# Altium project Projeto_DAC_Raspberry.PrjPcb (part 2 of 2)

## Sheet Amp_op2.SchDoc: AmpOps de Potência
size A3; Address1: UFCG; Address2: Laboratório VIRTUS CC; Address3: Campina Grande, PB - Brasil; SheetNumber: 5; SheetTotal: 8; Project: HAT RPi 4 - Phase Shifter Fotônico; DocumentRev: 01; SCH_SCALE: N/A; Version: v1.0
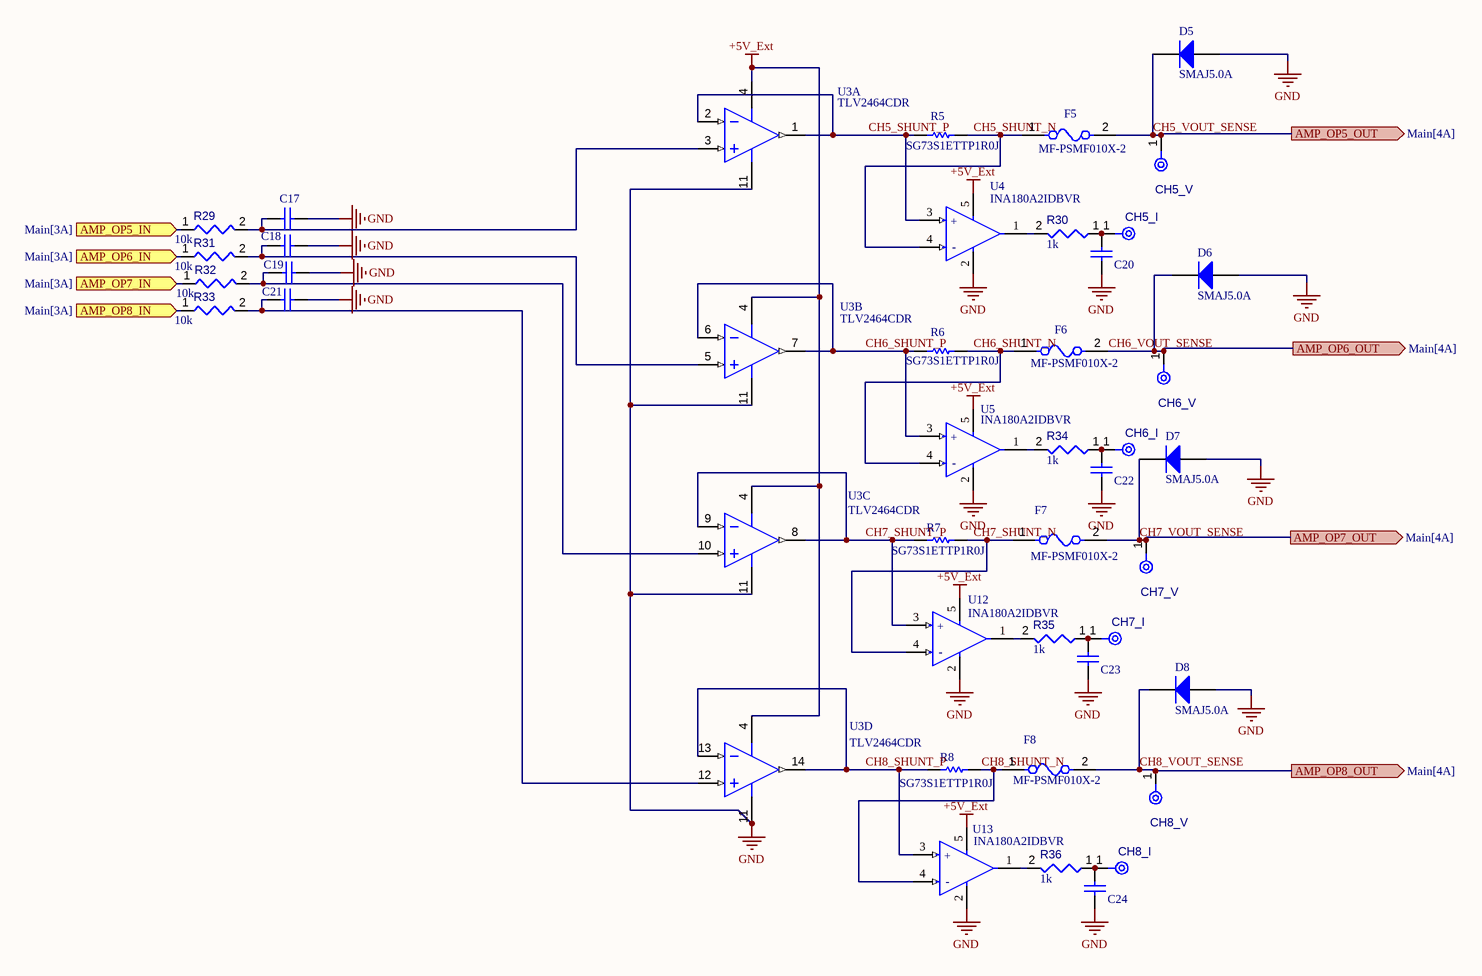
[diagram p4: Amp_op2.SchDoc]

### Parts
C17  VJ0603Y104MXJCW1BC  [CAPC1608X95X40NL15T15]  (value not drawn)
C18  VJ0603Y104MXJCW1BC  [CAPC1608X95X40NL15T15]  (value not drawn)
C19  VJ0603Y104MXJCW1BC  [CAPC1608X95X40NL15T15]  (value not drawn)
C20  VJ0603Y104MXJCW1BC  [CAPC1608X95X40NL15T15]  (value not drawn)
C21  VJ0603Y104MXJCW1BC  [CAPC1608X95X40NL15T15]  (value not drawn)
C22  VJ0603Y104MXJCW1BC  [CAPC1608X95X40NL15T15]  (value not drawn)
C23  VJ0603Y104MXJCW1BC  [CAPC1608X95X40NL15T15]  (value not drawn)
C24  VJ0603Y104MXJCW1BC  [CAPC1608X95X40NL15T15]  (value not drawn)
CH5_I  TPAD6R  [TP06R]  (value not drawn)  (no BOM)
CH5_V  TPAD6R  [TP06R]  (value not drawn)  (no BOM)
CH6_I  TPAD6R  [TP06R]  (value not drawn)  (no BOM)
CH6_V  TPAD6R  [TP06R]  (value not drawn)  (no BOM)
CH7_I  TPAD6R  [TP06R]  (value not drawn)  (no BOM)
CH7_V  TPAD6R  [TP06R]  (value not drawn)  (no BOM)
CH8_I  TPAD6R  [TP06R]  (value not drawn)  (no BOM)
CH8_V  TPAD6R  [TP06R]  (value not drawn)  (no BOM)
D5  SMAJ5.0A  [BOUR-SMA-2_V]
D6  SMAJ5.0A  [BOUR-SMA-2_V]
D7  SMAJ5.0A  [BOUR-SMA-2_V]
D8  SMAJ5.0A  [BOUR-SMA-2_V]
F5  MF-PSMF010X-2  [FP-MF-PSMF-MFG]
F6  MF-PSMF010X-2  [FP-MF-PSMF-MFG]
F7  MF-PSMF010X-2  [FP-MF-PSMF-MFG]
F8  MF-PSMF010X-2  [FP-MF-PSMF-MFG]
R5  SG73S1ETTP1R0J  [RESC1005X40X25LL10T10]
R6  SG73S1ETTP1R0J  [RESC1005X40X25LL10T10]
R7  SG73S1ETTP1R0J  [RESC1005X40X25LL10T10]
R8  SG73S1ETTP1R0J  [RESC1005X40X25LL10T10]
R29  value 10k  [RESC0603(1608)_L]  (hidden comment: Resistor 10k +/-1% 0603 100 mW)
R30  value 1k  [RESC0603(1608)_L]  (hidden comment: Resistor 1k +/-1% 0603 100 mW)
R31  value 10k  [RESC0603(1608)_L]  (hidden comment: Resistor 10k +/-1% 0603 100 mW)
R32  value 10k  [RESC0603(1608)_L]  (hidden comment: Resistor 10k +/-1% 0603 100 mW)
R33  value 10k  [RESC0603(1608)_L]  (hidden comment: Resistor 10k +/-1% 0603 100 mW)
R34  value 1k  [RESC0603(1608)_L]  (hidden comment: Resistor 1k +/-1% 0603 100 mW)
R35  value 1k  [RESC0603(1608)_L]  (hidden comment: Resistor 1k +/-1% 0603 100 mW)
R36  value 1k  [RESC0603(1608)_L]  (hidden comment: Resistor 1k +/-1% 0603 100 mW)
U3  TLV2464CDR  [D0014A_N]  (parts A,B,C,D of 4)
U4  INA180A2IDBVR  [FP-DBV0005A-MFG]
U5  INA180A2IDBVR  [FP-DBV0005A-MFG]
U12  INA180A2IDBVR  [FP-DBV0005A-MFG]
U13  INA180A2IDBVR  [FP-DBV0005A-MFG]

### Ports
AMP_OP5_IN (in, see Main[3A]), AMP_OP5_OUT (out, see Main[4A]), AMP_OP6_IN (in, see Main[3A]), AMP_OP6_OUT (out, see Main[4A]), AMP_OP7_IN (in, see Main[3A]), AMP_OP7_OUT (out, see Main[4A]), AMP_OP8_IN (in, see Main[3A]), AMP_OP8_OUT (out, see Main[4A])

### Nets
+5V_Ext: U3.4(VDD+) U4.5(VS) U5.5(VS) U12.5(VS) U13.5(VS)
GND: C17.2 C18.2 C19.2 C20.2 C21.2 C22.2 C23.2 C24.2 D5.1(A) D6.1(A) D7.1(A) D8.1(A) U3.11(GND) U4.2(GND) U5.2(GND) U12.2(GND) U13.2(GND)
CH5_SHUNT_N: F5.1 R5.2 U4.4(IN-)
CH5_SHUNT_P: R5.1 U3.1(OUT1) U3.2(IN1-) U4.3(IN+)
CH5_VOUT_SENSE: CH5_V.1(TP) D5.2(K) F5.2 ; port AMP_OP5_OUT
CH6_SHUNT_N: F6.1 R6.2 U5.4(IN-)
CH6_SHUNT_P: R6.1 U3.6(IN2-) U3.7(OUT2) U5.3(IN+)
CH6_VOUT_SENSE: CH6_V.1(TP) D6.2(K) F6.2 ; port AMP_OP6_OUT
CH7_SHUNT_N: F7.1 R7.2 U12.4(IN-)
CH7_SHUNT_P: R7.1 U3.8(OUT3) U3.9(IN3-) U12.3(IN+)
CH7_VOUT_SENSE: CH7_V.1(TP) D7.2(K) F7.2 ; port AMP_OP7_OUT
CH8_SHUNT_N: F8.1 R8.2 U13.4(IN-)
CH8_SHUNT_P: R8.1 U3.13(IN4-) U3.14(OUT4) U13.3(IN+)
CH8_VOUT_SENSE: CH8_V.1(TP) D8.2(K) F8.2 ; port AMP_OP8_OUT
NetC17_1: C17.1 R29.2 U3.3(IN1+)
NetC18_1: C18.1 R31.2 U3.5(IN2+)
NetC19_1: C19.1 R32.2 U3.10(IN3+)
NetC20_1: C20.1 CH5_I.1(TP) R30.1
NetC21_1: C21.1 R33.2 U3.12(IN4+)
NetC22_1: C22.1 CH6_I.1(TP) R34.1
NetC23_1: C23.1 CH7_I.1(TP) R35.1
NetC24_1: C24.1 CH8_I.1(TP) R36.1
NetR29_1: R29.1 ; port AMP_OP5_IN
NetR30_2: R30.2 U4.1(OUT)
NetR31_1: R31.1 ; port AMP_OP6_IN
NetR32_1: R32.1 ; port AMP_OP7_IN
NetR33_1: R33.1 ; port AMP_OP8_IN
NetR34_2: R34.2 U5.1(OUT)
NetR35_2: R35.2 U12.1(OUT)
NetR36_2: R36.2 U13.1(OUT)

### Notes on the sheet
- REVISION
- DESCRIPTION
- DATE
- APPROVED
- ADDRESS
- PROJECT
- VERSION
- TITLE
- A3
- SIZE
- SCALE
- DOCUMENT NAME:
- DOCUMENT REVISION:
- OF
- SHEET:
- PROJECT REVISION:
- (in symbol CMP-04895-000287-1) +; -

### Library data of the parts
C17-C24 = CMP-2006-00058-1: Manufacturer: Vitramon; Part Number: VJ0603Y104MXJCW1BC
CH5_I CH5_V CH6_I CH6_V CH7_I CH7_V CH8_I CH8_V = CMP-00028-00002-2: 0.6mm round; Pins: 1; Component Type: Mechanical
D5-D8 = CMP-2000-07090-1: SMAJ Transient Voltage Suppressor Diode Series, 3.5 V, -55 to 150 degC, 2-Pin SMA, RoHS, Tape and Reel; Manufacturer: Bourns; EDA / CAD Models: DownloadfromAcceleratedDesigns; Unidirectional Channels: 1; Voltage - Breakdown (Min): 6.4V; Voltage - Reverse Standoff (Typ): 5V; Voltage - Clamping (Max) @ Ipp: 9.2V; Other Names: SMAJ5.0ABDKR; Type: Zener; Catalog Drawings: SMAJSeriesFootprintSMAJ,SMBJSeries; Featured Product: SMAJ/SMBJ/SMCJ/SMLJDiscreteTVSDiodes; Power - Peak Pulse: 400W; Current - Peak Pulse (10/1000µs): 43.5A; Power Line Protection: No; Online Catalog: SMAJSeries; Supplier Device Package: SMA(DO-214AC); Operating Temperature: -55°C~150°C(TJ); Package Description: 2-Pin Surface Mount Device, Body 4.315 x 2.605 mm; Datasheet URL: https://datasheet.ciiva.com/25624/0900766b8112213b-25624680.pdf; Manufacturer URL: http://www.bourns.com/; Datasheet Version: 08/2012; Series: SMAJ; Family: TVS-Diodes; Bidirectional Channels: -; Applications: GeneralPurpose; Package Reference: SMA-2; Standard Package: 1; Package / Case: DO-214AC,SMA; Category: CircuitProtection; RoHS Information: SMAJSeriesMaterialDeclaration; Mounting Technology: SurfaceMount; Capacitance @ Frequency: -; Packaging: Digi-Reel®; Mounting Type: SurfaceMount
F5-F8 = CMP-07400-000017-1: PTC RESET FUSE 15V 100MA 0805; Manufacturer: Bourns Inc.; Resistance: 1-7.5Ω; Value: 1-7.5Ω; Current Rating: 40A; Hold Current: 0.1A; Trip Current: 0.3A; Trip Time: 1.5s; Temperature: -40°C to +85°C; ComponentLink2Description: Datasheet; Lead Free: Yes; Ipc Land Pattern Name: CAPC215135X67; Device Class L1: Circuit Protection; Mouser Description: Resettable Fuses - PPTC 0.10A 15V 1ohm; Automotive: No; Octopart: https://octopart.com/mf-psmf010x-2-bourns-7483441; Manufacturer Part Number: MF-PSMF010X-2; RoHS: TRUE; Temperature Range High: +85°C; Digikey Description: PTC RESET FUSE 15V 100MA 0805; Device Class L3: unset; ComponentLink2URL: https://www.bourns.com/docs/Product-Datasheets/mfpsmf.pdf; Height: 0.85mm; Voltage Rating: 15V; Ambient Temperature Range Low: -40°C; Category: Fuse; Package: MF-PSMF; Temperature Range Low: -40°C; Device Class L2: PTC Resettable Fuses; Ambient Temperature Range High: +85°C
R5-R8 = CMP-2002-04124-1: Manufacturer: KOA Speer; Part Number: SG73S1ETTP1R0J
R29 R31-R33 = CMP-009-00017-7: Chip Resistor, 10 KOhm, +/- 1%, 01 W, -55 to 155 degC, 0603 (1608 Metric); Manufacturer: Vishay; Manufacturer Part Number: CRCW060310K0FKEA; Voltage Rating: 50V; Power: 100mW; RoHS Compliant: True; Min Operating Temperature: -55°C; Pins: 2; Case/Package: 0603; Mounting Technology: SM; Max Operating Temperature: 155°C; Tolerance: 1%; Component Type: Resistors
R30 R34-R36 = CMP-009-00014-6: Chip Resistor, 1 KOhm, +/-1%, 0.1 W, -55 to 155 degC, 0603 (1608 Metric); Manufacturer: Yageo; Manufacturer Part Number: RC0603FR-131KL; Power: 100mW; Tolerance: 1%; Voltage Rating: 50V; Mounting Technology: SM; Case/Package: 0603; Min Operating Temperature: -55°C; RoHS Compliant: True; Max Operating Temperature: 155°C; Pins: 2; Component Type: Resistors
U3 = CMP-0271-00006-3: Quad Low Power, Rail-to-Rail Input / Output Operational Amplifier, 2.7 to 6 V, 0 to 70 degC, 14-pin SOIC (D14), Green (RoHS & no Sb/Br); Manufacturer: Texas Instruments; Offset Drift(Typ)(uV/C): 2; Total Supply Voltage(Min)(+5V is 5, +/-5V is 10): 2.7; IIB(Max)(pA): 14000; CMRR(Min)(dB): 66; Iq per channel(Max)(mA): 0.575; Vn at 1kHz(Typ)(nV/rtHz): 11; Slew Rate(Typ)(V/us): 1.6; Number of Channels: 4; Sub Family: High Output Current Amplifier (>=50mA), Low Supply Voltage Amplifier (<=2.7V), Precision Amplifier; Total Supply Voltage(Max)(+5V is 5, +/-5V is 10): 6; ComponentLink3URL: http://www.ti.com/lit/ml/mpds177g/mpds177g.pdf; ComponentLink1Description: Manufacturer URL; PackageReference: D0014A; Vio (25C)(Max)(mV): 2; Mounting Technology: Surface Mount; PackageDescription: 14-Pin Plastic Small Outline, Body 8.65 x 3.9 mm, Pitch 1.27 mm; ComponentLink2Description: Datasheet; ComponentLink3Description: Package Specification; ComponentLink1URL: http://www.ti.com/; DatasheetVersion: SLOS220J; PartNumber: TLV2464CDR; Code_JEDEC: MS-012; PackageVersion: 4040047-5/M, 06/2011; ComponentLink2URL: http://www.ti.com/general/docs/lit/getliterature.tsp?genericPartNumber=TLV2464&fileType=pdf; Eco-Plan: Green (RoHS & no Sb/Br)
U4 U5 U12 U13 = CMP-04895-000287-1: IC CURR SENSE 1 CIRCUIT SOT23-5; Operating Supply Current: 260uA; -3db Bandwidth: 350kHz; Slew Rate: 2V/µs; Number of Circuits: 1; Input Offset Voltage (Vos): 100uV; Input Bias Current: 100nA; Mount: Surface Mount; Max Operating Temperature: 125°C; Packaging: Tape and Reel; Min Operating Temperature: -40°C; Case/Package: SOT-23-5; RoHS Compliant: Yes

## Sheet Amp_op3.SchDoc: AmpOps de Potência
size A3; Address1: UFCG; Address2: Laboratório VIRTUS CC; Address3: Campina Grande, PB - Brasil; SheetNumber: 5; SheetTotal: 7; DocumentRev: 01; Project: HAT RPi 4 - Phase Shifter Fotônico; SCH_SCALE: N/A; Version: v1.0
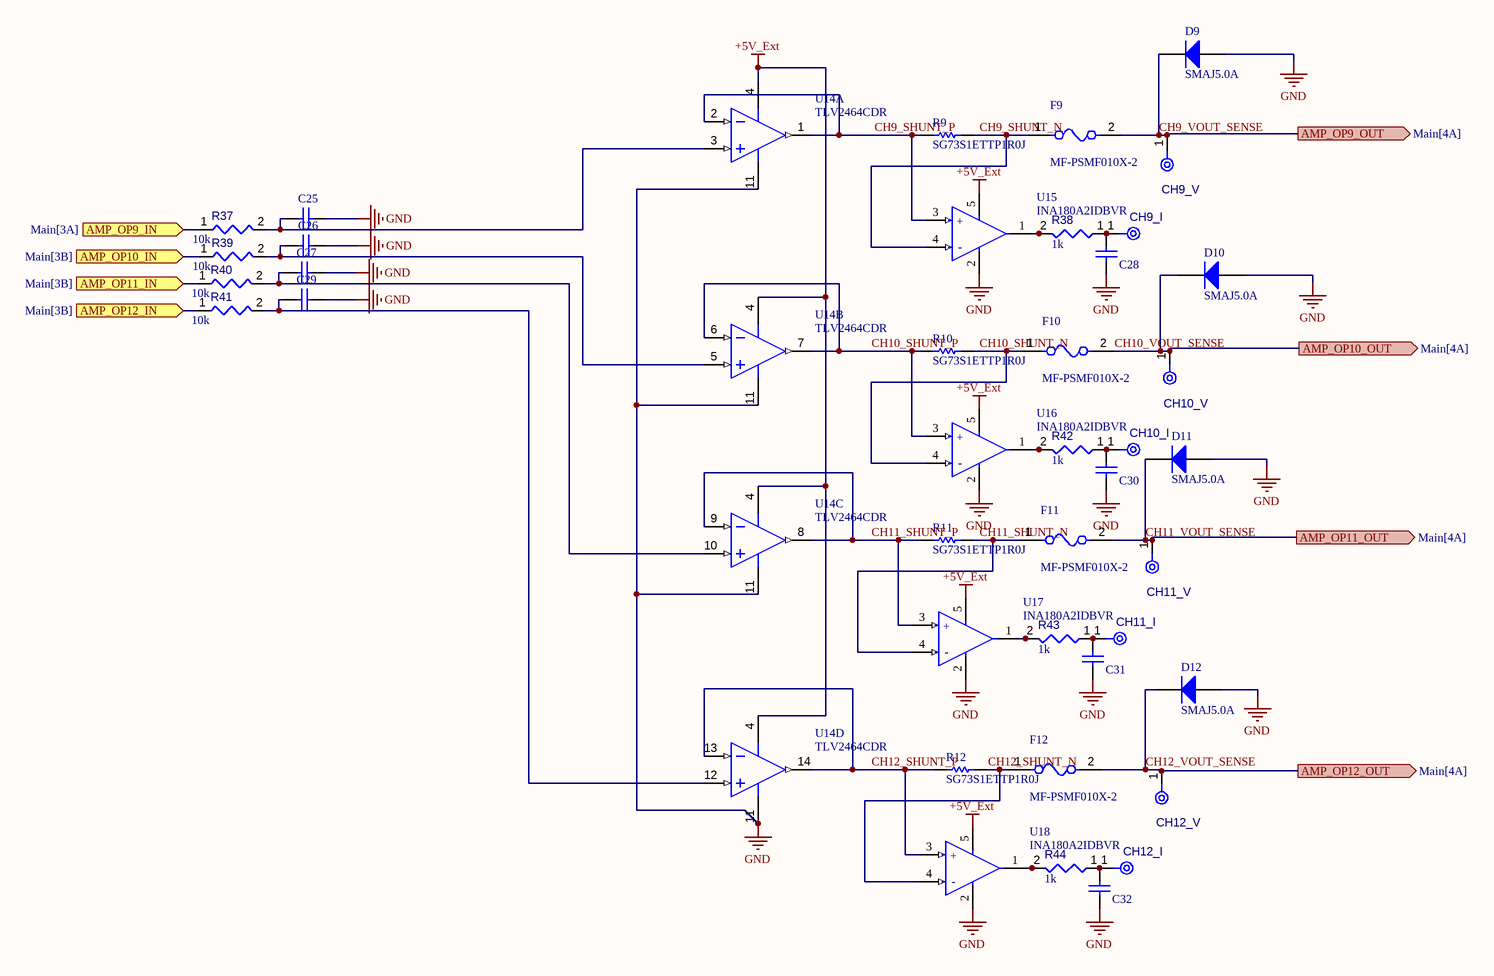
[diagram p5: Amp_op3.SchDoc]

### Parts
C25  VJ0603Y104MXJCW1BC  [CAPC1608X95X40NL15T15]  (value not drawn)
C26  VJ0603Y104MXJCW1BC  [CAPC1608X95X40NL15T15]  (value not drawn)
C27  VJ0603Y104MXJCW1BC  [CAPC1608X95X40NL15T15]  (value not drawn)
C28  VJ0603Y104MXJCW1BC  [CAPC1608X95X40NL15T15]  (value not drawn)
C29  VJ0603Y104MXJCW1BC  [CAPC1608X95X40NL15T15]  (value not drawn)
C30  VJ0603Y104MXJCW1BC  [CAPC1608X95X40NL15T15]  (value not drawn)
C31  VJ0603Y104MXJCW1BC  [CAPC1608X95X40NL15T15]  (value not drawn)
C32  VJ0603Y104MXJCW1BC  [CAPC1608X95X40NL15T15]  (value not drawn)
CH9_I  TPAD6R  [TP06R]  (value not drawn)  (no BOM)
CH9_V  TPAD6R  [TP06R]  (value not drawn)  (no BOM)
CH10_I  TPAD6R  [TP06R]  (value not drawn)  (no BOM)
CH10_V  TPAD6R  [TP06R]  (value not drawn)  (no BOM)
CH11_I  TPAD6R  [TP06R]  (value not drawn)  (no BOM)
CH11_V  TPAD6R  [TP06R]  (value not drawn)  (no BOM)
CH12_I  TPAD6R  [TP06R]  (value not drawn)  (no BOM)
CH12_V  TPAD6R  [TP06R]  (value not drawn)  (no BOM)
D9  SMAJ5.0A  [BOUR-SMA-2_V]
D10  SMAJ5.0A  [BOUR-SMA-2_V]
D11  SMAJ5.0A  [BOUR-SMA-2_V]
D12  SMAJ5.0A  [BOUR-SMA-2_V]
F9  MF-PSMF010X-2  [FP-MF-PSMF-MFG]
F10  MF-PSMF010X-2  [FP-MF-PSMF-MFG]
F11  MF-PSMF010X-2  [FP-MF-PSMF-MFG]
F12  MF-PSMF010X-2  [FP-MF-PSMF-MFG]
R9  SG73S1ETTP1R0J  [RESC1005X40X25LL10T10]
R10  SG73S1ETTP1R0J  [RESC1005X40X25LL10T10]
R11  SG73S1ETTP1R0J  [RESC1005X40X25LL10T10]
R12  SG73S1ETTP1R0J  [RESC1005X40X25LL10T10]
R37  value 10k  [RESC0603(1608)_L]  (hidden comment: Resistor 10k +/-1% 0603 100 mW)
R38  value 1k  [RESC0603(1608)_L]  (hidden comment: Resistor 1k +/-1% 0603 100 mW)
R39  value 10k  [RESC0603(1608)_L]  (hidden comment: Resistor 10k +/-1% 0603 100 mW)
R40  value 10k  [RESC0603(1608)_L]  (hidden comment: Resistor 10k +/-1% 0603 100 mW)
R41  value 10k  [RESC0603(1608)_L]  (hidden comment: Resistor 10k +/-1% 0603 100 mW)
R42  value 1k  [RESC0603(1608)_L]  (hidden comment: Resistor 1k +/-1% 0603 100 mW)
R43  value 1k  [RESC0603(1608)_L]  (hidden comment: Resistor 1k +/-1% 0603 100 mW)
R44  value 1k  [RESC0603(1608)_L]  (hidden comment: Resistor 1k +/-1% 0603 100 mW)
U14  TLV2464CDR  [D0014A_N]  (parts A,B,C,D of 4)
U15  INA180A2IDBVR  [FP-DBV0005A-MFG]
U16  INA180A2IDBVR  [FP-DBV0005A-MFG]
U17  INA180A2IDBVR  [FP-DBV0005A-MFG]
U18  INA180A2IDBVR  [FP-DBV0005A-MFG]

### Ports
AMP_OP9_IN (in, see Main[3A]), AMP_OP9_OUT (out, see Main[4A]), AMP_OP10_IN (in, see Main[3B]), AMP_OP10_OUT (out, see Main[4A]), AMP_OP11_IN (in, see Main[3B]), AMP_OP11_OUT (out, see Main[4A]), AMP_OP12_IN (in, see Main[3B]), AMP_OP12_OUT (out, see Main[4A])

### Nets
+5V_Ext: U14.4(VDD+) U15.5(VS) U16.5(VS) U17.5(VS) U18.5(VS)
GND: C25.2 C26.2 C27.2 C28.2 C29.2 C30.2 C31.2 C32.2 D9.1(A) D10.1(A) D11.1(A) D12.1(A) U14.11(GND) U15.2(GND) U16.2(GND) U17.2(GND) U18.2(GND)
CH9_SHUNT_N: F9.1 R9.2 U15.4(IN-)
CH9_SHUNT_P: R9.1 U14.1(OUT1) U14.2(IN1-) U15.3(IN+)
CH9_VOUT_SENSE: CH9_V.1(TP) D9.2(K) F9.2 ; port AMP_OP9_OUT
CH10_SHUNT_N: F10.1 R10.2 U16.4(IN-)
CH10_SHUNT_P: R10.1 U14.6(IN2-) U14.7(OUT2) U16.3(IN+)
CH10_VOUT_SENSE: CH10_V.1(TP) D10.2(K) F10.2 ; port AMP_OP10_OUT
CH11_SHUNT_N: F11.1 R11.2 U17.4(IN-)
CH11_SHUNT_P: R11.1 U14.8(OUT3) U14.9(IN3-) U17.3(IN+)
CH11_VOUT_SENSE: CH11_V.1(TP) D11.2(K) F11.2 ; port AMP_OP11_OUT
CH12_SHUNT_N: F12.1 R12.2 U18.4(IN-)
CH12_SHUNT_P: R12.1 U14.13(IN4-) U14.14(OUT4) U18.3(IN+)
CH12_VOUT_SENSE: CH12_V.1(TP) D12.2(K) F12.2 ; port AMP_OP12_OUT
NetC25_1: C25.1 R37.2 U14.3(IN1+)
NetC26_1: C26.1 R39.2 U14.5(IN2+)
NetC27_1: C27.1 R40.2 U14.10(IN3+)
NetC28_1: C28.1 CH9_I.1(TP) R38.1
NetC29_1: C29.1 R41.2 U14.12(IN4+)
NetC30_1: C30.1 CH10_I.1(TP) R42.1
NetC31_1: C31.1 CH11_I.1(TP) R43.1
NetC32_1: C32.1 CH12_I.1(TP) R44.1
NetR37_1: R37.1 ; port AMP_OP9_IN
NetR38_2: R38.2 U15.1(OUT)
NetR39_1: R39.1 ; port AMP_OP10_IN
NetR40_1: R40.1 ; port AMP_OP11_IN
NetR41_1: R41.1 ; port AMP_OP12_IN
NetR42_2: R42.2 U16.1(OUT)
NetR43_2: R43.2 U17.1(OUT)
NetR44_2: R44.2 U18.1(OUT)

### Notes on the sheet
- REVISION
- DESCRIPTION
- DATE
- APPROVED
- ADDRESS
- PROJECT
- VERSION
- TITLE
- A3
- SIZE
- SCALE
- DOCUMENT NAME:
- DOCUMENT REVISION:
- OF
- SHEET:
- PROJECT REVISION:
- (in symbol CMP-04895-000287-1) +; -

### Library data of the parts
C25-C32 = CMP-2006-00058-1: Manufacturer: Vitramon; Part Number: VJ0603Y104MXJCW1BC
CH9_I CH9_V CH10_I CH10_V CH11_I CH11_V CH12_I CH12_V = CMP-00028-00002-2: 0.6mm round; Pins: 1; Component Type: Mechanical
D9-D12 = CMP-2000-07090-1: as D5 on sheet Amp_op2; Supplier Device Package: SMA(DO-214AC); Operating Temperature: -55°C~150°C(TJ); Package Description: 2-Pin Surface Mount Device, Body 4.315 x 2.605 mm; Datasheet URL: https://datasheet.ciiva.com/25624/0900766b8112213b-25624680.pdf; Manufacturer URL: http://www.bourns.com/; Datasheet Version: 08/2012; Series: SMAJ; Family: TVS-Diodes; Bidirectional Channels: -; Applications: GeneralPurpose; Package Reference: SMA-2; Standard Package: 1; Package / Case: DO-214AC,SMA; Category: CircuitProtection; RoHS Information: SMAJSeriesMaterialDeclaration; Mounting Technology: SurfaceMount; Capacitance @ Frequency: -; Packaging: Digi-Reel®; Mounting Type: SurfaceMount
F9-F12 = CMP-07400-000017-1: as F5 on sheet Amp_op2; Temperature: -40°C to +85°C; ComponentLink2Description: Datasheet; Lead Free: Yes; Ipc Land Pattern Name: CAPC215135X67; Device Class L1: Circuit Protection; Mouser Description: Resettable Fuses - PPTC 0.10A 15V 1ohm; Automotive: No; Octopart: https://octopart.com/mf-psmf010x-2-bourns-7483441; Manufacturer Part Number: MF-PSMF010X-2; RoHS: TRUE; Temperature Range High: +85°C; Digikey Description: PTC RESET FUSE 15V 100MA 0805; Device Class L3: unset; ComponentLink2URL: https://www.bourns.com/docs/Product-Datasheets/mfpsmf.pdf; Height: 0.85mm; Voltage Rating: 15V; Ambient Temperature Range Low: -40°C; Category: Fuse; Package: MF-PSMF; Temperature Range Low: -40°C; Device Class L2: PTC Resettable Fuses; Ambient Temperature Range High: +85°C
R9-R12 = CMP-2002-04124-1: Manufacturer: KOA Speer; Part Number: SG73S1ETTP1R0J
R37 R39-R41 = CMP-009-00017-7: as R29 on sheet Amp_op2; RoHS Compliant: True; Min Operating Temperature: -55°C; Pins: 2; Case/Package: 0603; Mounting Technology: SM; Max Operating Temperature: 155°C; Tolerance: 1%; Component Type: Resistors
R38 R42-R44 = CMP-009-00014-6: as R30 on sheet Amp_op2; Mounting Technology: SM; Case/Package: 0603; Min Operating Temperature: -55°C; RoHS Compliant: True; Max Operating Temperature: 155°C; Pins: 2; Component Type: Resistors
U14 = CMP-0271-00006-3: as U3 on sheet Amp_op2; ComponentLink3URL: http://www.ti.com/lit/ml/mpds177g/mpds177g.pdf; ComponentLink1Description: Manufacturer URL; PackageReference: D0014A; Vio (25C)(Max)(mV): 2; Mounting Technology: Surface Mount; PackageDescription: 14-Pin Plastic Small Outline, Body 8.65 x 3.9 mm, Pitch 1.27 mm; ComponentLink2Description: Datasheet; ComponentLink3Description: Package Specification; ComponentLink1URL: http://www.ti.com/; DatasheetVersion: SLOS220J; PartNumber: TLV2464CDR; Code_JEDEC: MS-012; PackageVersion: 4040047-5/M, 06/2011; ComponentLink2URL: http://www.ti.com/general/docs/lit/getliterature.tsp?genericPartNumber=TLV2464&fileType=pdf; Eco-Plan: Green (RoHS & no Sb/Br)
U15-U18 = CMP-04895-000287-1: as U4 on sheet Amp_op2; Mount: Surface Mount; Max Operating Temperature: 125°C; Packaging: Tape and Reel; Min Operating Temperature: -40°C; Case/Package: SOT-23-5; RoHS Compliant: Yes

## Sheet Amp_op4.SchDoc: AmpOps de Potência
size A3; Address1: UFCG; Address2: Laboratório VIRTUS CC; Address3: Campina Grande, PB - Brasil; SheetNumber: 6; SheetTotal: 7; Project: HAT RPi 4 - Phase Shifter Fotônico; Version: v1.0; SCH_SCALE: N/A
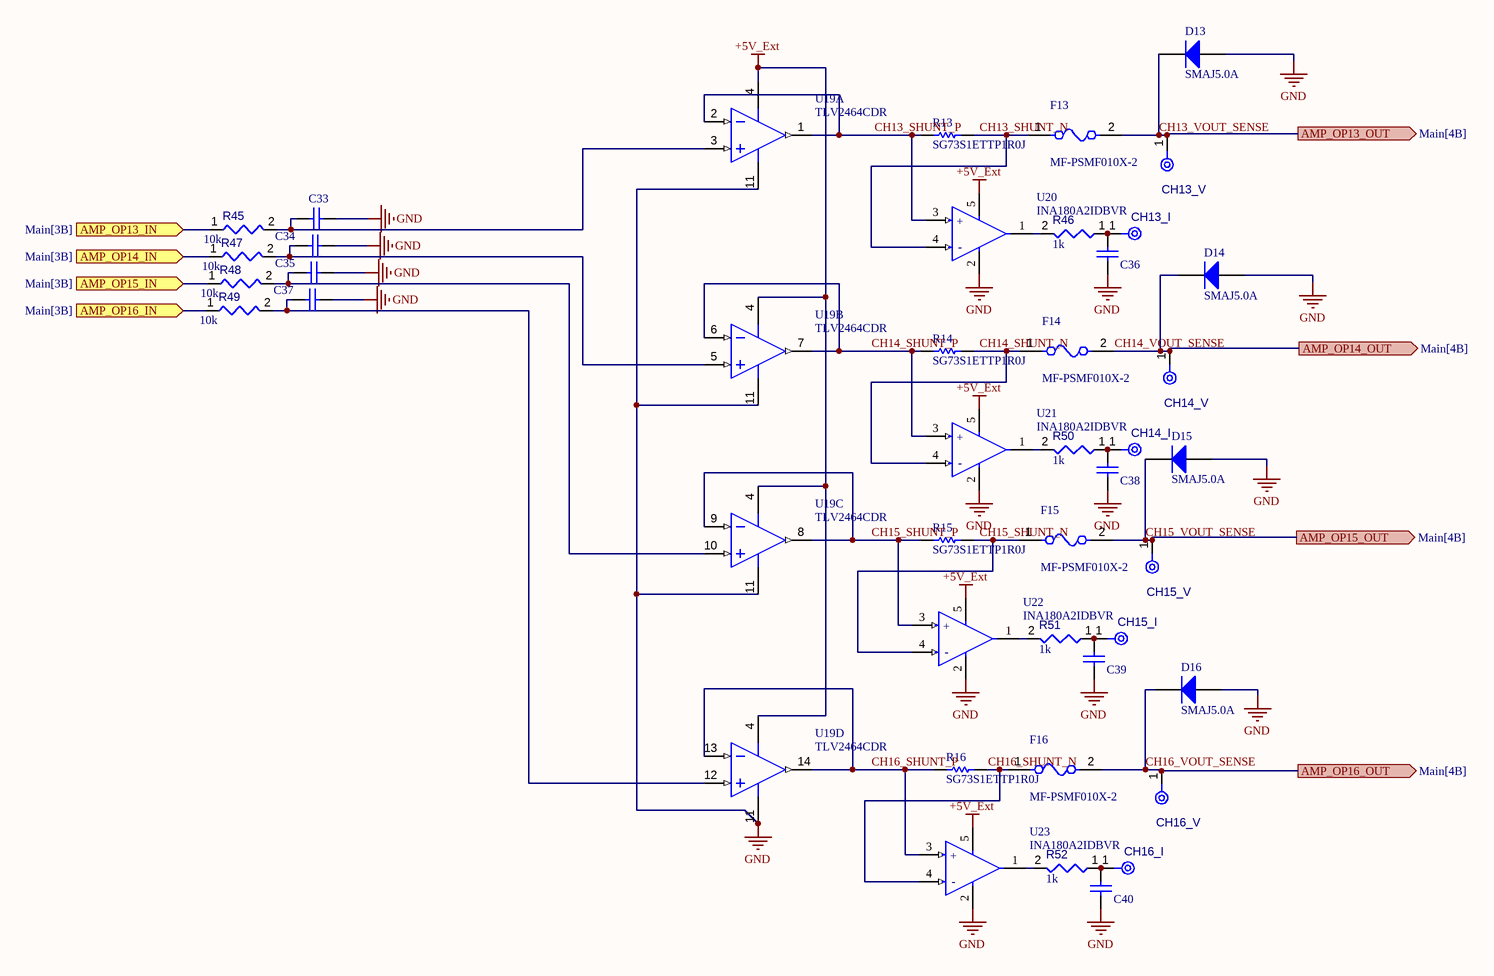
[diagram p6: Amp_op4.SchDoc]

### Parts
C33  VJ0603Y104MXJCW1BC  [CAPC1608X95X40NL15T15]  (value not drawn)
C34  VJ0603Y104MXJCW1BC  [CAPC1608X95X40NL15T15]  (value not drawn)
C35  VJ0603Y104MXJCW1BC  [CAPC1608X95X40NL15T15]  (value not drawn)
C36  VJ0603Y104MXJCW1BC  [CAPC1608X95X40NL15T15]  (value not drawn)
C37  VJ0603Y104MXJCW1BC  [CAPC1608X95X40NL15T15]  (value not drawn)
C38  VJ0603Y104MXJCW1BC  [CAPC1608X95X40NL15T15]  (value not drawn)
C39  VJ0603Y104MXJCW1BC  [CAPC1608X95X40NL15T15]  (value not drawn)
C40  VJ0603Y104MXJCW1BC  [CAPC1608X95X40NL15T15]  (value not drawn)
CH13_I  TPAD6R  [TP06R]  (value not drawn)  (no BOM)
CH13_V  TPAD6R  [TP06R]  (value not drawn)  (no BOM)
CH14_I  TPAD6R  [TP06R]  (value not drawn)  (no BOM)
CH14_V  TPAD6R  [TP06R]  (value not drawn)  (no BOM)
CH15_I  TPAD6R  [TP06R]  (value not drawn)  (no BOM)
CH15_V  TPAD6R  [TP06R]  (value not drawn)  (no BOM)
CH16_I  TPAD6R  [TP06R]  (value not drawn)  (no BOM)
CH16_V  TPAD6R  [TP06R]  (value not drawn)  (no BOM)
D13  SMAJ5.0A  [BOUR-SMA-2_V]
D14  SMAJ5.0A  [BOUR-SMA-2_V]
D15  SMAJ5.0A  [BOUR-SMA-2_V]
D16  SMAJ5.0A  [BOUR-SMA-2_V]
F13  MF-PSMF010X-2  [FP-MF-PSMF-MFG]
F14  MF-PSMF010X-2  [FP-MF-PSMF-MFG]
F15  MF-PSMF010X-2  [FP-MF-PSMF-MFG]
F16  MF-PSMF010X-2  [FP-MF-PSMF-MFG]
R13  SG73S1ETTP1R0J  [RESC1005X40X25LL10T10]
R14  SG73S1ETTP1R0J  [RESC1005X40X25LL10T10]
R15  SG73S1ETTP1R0J  [RESC1005X40X25LL10T10]
R16  SG73S1ETTP1R0J  [RESC1005X40X25LL10T10]
R45  value 10k  [RESC0603(1608)_L]  (hidden comment: Resistor 10k +/-1% 0603 100 mW)
R46  value 1k  [RESC0603(1608)_L]  (hidden comment: Resistor 1k +/-1% 0603 100 mW)
R47  value 10k  [RESC0603(1608)_L]  (hidden comment: Resistor 10k +/-1% 0603 100 mW)
R48  value 10k  [RESC0603(1608)_L]  (hidden comment: Resistor 10k +/-1% 0603 100 mW)
R49  value 10k  [RESC0603(1608)_L]  (hidden comment: Resistor 10k +/-1% 0603 100 mW)
R50  value 1k  [RESC0603(1608)_L]  (hidden comment: Resistor 1k +/-1% 0603 100 mW)
R51  value 1k  [RESC0603(1608)_L]  (hidden comment: Resistor 1k +/-1% 0603 100 mW)
R52  value 1k  [RESC0603(1608)_L]  (hidden comment: Resistor 1k +/-1% 0603 100 mW)
U19  TLV2464CDR  [D0014A_N]  (parts A,B,C,D of 4)
U20  INA180A2IDBVR  [FP-DBV0005A-MFG]
U21  INA180A2IDBVR  [FP-DBV0005A-MFG]
U22  INA180A2IDBVR  [FP-DBV0005A-MFG]
U23  INA180A2IDBVR  [FP-DBV0005A-MFG]

### Ports
AMP_OP13_IN (in, see Main[3B]), AMP_OP13_OUT (out, see Main[4B]), AMP_OP14_IN (in, see Main[3B]), AMP_OP14_OUT (out, see Main[4B]), AMP_OP15_IN (in, see Main[3B]), AMP_OP15_OUT (out, see Main[4B]), AMP_OP16_IN (in, see Main[3B]), AMP_OP16_OUT (out, see Main[4B])

### Nets
+5V_Ext: U19.4(VDD+) U20.5(VS) U21.5(VS) U22.5(VS) U23.5(VS)
GND: C33.2 C34.2 C35.2 C36.2 C37.2 C38.2 C39.2 C40.2 D13.1(A) D14.1(A) D15.1(A) D16.1(A) U19.11(GND) U20.2(GND) U21.2(GND) U22.2(GND) U23.2(GND)
CH13_SHUNT_N: F13.1 R13.2 U20.4(IN-)
CH13_SHUNT_P: R13.1 U19.1(OUT1) U19.2(IN1-) U20.3(IN+)
CH13_VOUT_SENSE: CH13_V.1(TP) D13.2(K) F13.2 ; port AMP_OP13_OUT
CH14_SHUNT_N: F14.1 R14.2 U21.4(IN-)
CH14_SHUNT_P: R14.1 U19.6(IN2-) U19.7(OUT2) U21.3(IN+)
CH14_VOUT_SENSE: CH14_V.1(TP) D14.2(K) F14.2 ; port AMP_OP14_OUT
CH15_SHUNT_N: F15.1 R15.2 U22.4(IN-)
CH15_SHUNT_P: R15.1 U19.8(OUT3) U19.9(IN3-) U22.3(IN+)
CH15_VOUT_SENSE: CH15_V.1(TP) D15.2(K) F15.2 ; port AMP_OP15_OUT
CH16_SHUNT_N: F16.1 R16.2 U23.4(IN-)
CH16_SHUNT_P: R16.1 U19.13(IN4-) U19.14(OUT4) U23.3(IN+)
CH16_VOUT_SENSE: CH16_V.1(TP) D16.2(K) F16.2 ; port AMP_OP16_OUT
NetC33_1: C33.1 R45.2 U19.3(IN1+)
NetC34_1: C34.1 R47.2 U19.5(IN2+)
NetC35_1: C35.1 R48.2 U19.10(IN3+)
NetC36_1: C36.1 CH13_I.1(TP) R46.1
NetC37_1: C37.1 R49.2 U19.12(IN4+)
NetC38_1: C38.1 CH14_I.1(TP) R50.1
NetC39_1: C39.1 CH15_I.1(TP) R51.1
NetC40_1: C40.1 CH16_I.1(TP) R52.1
NetR45_1: R45.1 ; port AMP_OP13_IN
NetR46_2: R46.2 U20.1(OUT)
NetR47_1: R47.1 ; port AMP_OP14_IN
NetR48_1: R48.1 ; port AMP_OP15_IN
NetR49_1: R49.1 ; port AMP_OP16_IN
NetR50_2: R50.2 U21.1(OUT)
NetR51_2: R51.2 U22.1(OUT)
NetR52_2: R52.2 U23.1(OUT)

### Notes on the sheet
- REVISION
- DESCRIPTION
- DATE
- APPROVED
- ADDRESS
- PROJECT
- VERSION
- TITLE
- A3
- SIZE
- SCALE
- DOCUMENT NAME:
- DOCUMENT REVISION:
- OF
- SHEET:
- PROJECT REVISION:
- (in symbol CMP-04895-000287-1) +; -

### Library data of the parts
C33-C40 = CMP-2006-00058-1: Manufacturer: Vitramon; Part Number: VJ0603Y104MXJCW1BC
CH13_I CH13_V CH14_I CH14_V CH15_I CH15_V CH16_I CH16_V = CMP-00028-00002-2: 0.6mm round; Pins: 1; Component Type: Mechanical
D13-D16 = CMP-2000-07090-1: as D5 on sheet Amp_op2; Supplier Device Package: SMA(DO-214AC); Operating Temperature: -55°C~150°C(TJ); Package Description: 2-Pin Surface Mount Device, Body 4.315 x 2.605 mm; Datasheet URL: https://datasheet.ciiva.com/25624/0900766b8112213b-25624680.pdf; Manufacturer URL: http://www.bourns.com/; Datasheet Version: 08/2012; Series: SMAJ; Family: TVS-Diodes; Bidirectional Channels: -; Applications: GeneralPurpose; Package Reference: SMA-2; Standard Package: 1; Package / Case: DO-214AC,SMA; Category: CircuitProtection; RoHS Information: SMAJSeriesMaterialDeclaration; Mounting Technology: SurfaceMount; Capacitance @ Frequency: -; Packaging: Digi-Reel®; Mounting Type: SurfaceMount
F13-F16 = CMP-07400-000017-1: as F5 on sheet Amp_op2; Temperature: -40°C to +85°C; ComponentLink2Description: Datasheet; Lead Free: Yes; Ipc Land Pattern Name: CAPC215135X67; Device Class L1: Circuit Protection; Mouser Description: Resettable Fuses - PPTC 0.10A 15V 1ohm; Automotive: No; Octopart: https://octopart.com/mf-psmf010x-2-bourns-7483441; Manufacturer Part Number: MF-PSMF010X-2; RoHS: TRUE; Temperature Range High: +85°C; Digikey Description: PTC RESET FUSE 15V 100MA 0805; Device Class L3: unset; ComponentLink2URL: https://www.bourns.com/docs/Product-Datasheets/mfpsmf.pdf; Height: 0.85mm; Voltage Rating: 15V; Ambient Temperature Range Low: -40°C; Category: Fuse; Package: MF-PSMF; Temperature Range Low: -40°C; Device Class L2: PTC Resettable Fuses; Ambient Temperature Range High: +85°C
R13-R16 = CMP-2002-04124-1: Manufacturer: KOA Speer; Part Number: SG73S1ETTP1R0J
R45 R47-R49 = CMP-009-00017-7: as R29 on sheet Amp_op2; RoHS Compliant: True; Min Operating Temperature: -55°C; Pins: 2; Case/Package: 0603; Mounting Technology: SM; Max Operating Temperature: 155°C; Tolerance: 1%; Component Type: Resistors
R46 R50-R52 = CMP-009-00014-6: as R30 on sheet Amp_op2; Mounting Technology: SM; Case/Package: 0603; Min Operating Temperature: -55°C; RoHS Compliant: True; Max Operating Temperature: 155°C; Pins: 2; Component Type: Resistors
U19 = CMP-0271-00006-3: as U3 on sheet Amp_op2; ComponentLink3URL: http://www.ti.com/lit/ml/mpds177g/mpds177g.pdf; ComponentLink1Description: Manufacturer URL; PackageReference: D0014A; Vio (25C)(Max)(mV): 2; Mounting Technology: Surface Mount; PackageDescription: 14-Pin Plastic Small Outline, Body 8.65 x 3.9 mm, Pitch 1.27 mm; ComponentLink2Description: Datasheet; ComponentLink3Description: Package Specification; ComponentLink1URL: http://www.ti.com/; DatasheetVersion: SLOS220J; PartNumber: TLV2464CDR; Code_JEDEC: MS-012; PackageVersion: 4040047-5/M, 06/2011; ComponentLink2URL: http://www.ti.com/general/docs/lit/getliterature.tsp?genericPartNumber=TLV2464&fileType=pdf; Eco-Plan: Green (RoHS & no Sb/Br)
U20-U23 = CMP-04895-000287-1: as U4 on sheet Amp_op2; Mount: Surface Mount; Max Operating Temperature: 125°C; Packaging: Tape and Reel; Min Operating Temperature: -40°C; Case/Package: SOT-23-5; RoHS Compliant: Yes

## Sheet Capacitores.SchDoc: Filtros
size A3; Address1: UFCG; Address2: Laboratório VIRTUS CC; Address3: Campina Grande, PB - Brasil; SheetNumber: 8; SheetTotal: 8; Project: HAT RPi 4 - Phase Shifter Fotônico; DocumentRev: 01; SCH_SCALE: N/A; Version: v1.0
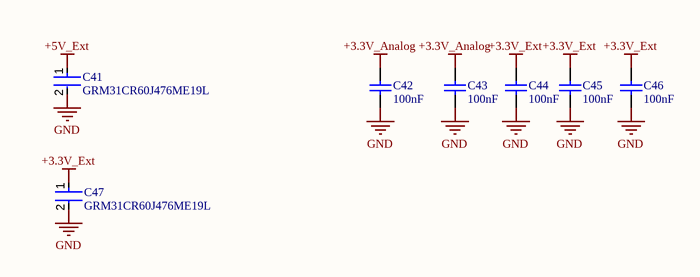
[diagram p7: Capacitores.SchDoc]

### Parts
C41  GRM31CR60J476ME19L  [FP-GRM31C-0_2-e0_3_0_8-IPC_C]
C42  value 100nF  [CAPC0603(1608)100_L]  (hidden comment: VJ0603Y104MXJCW1BC)
C43  value 100nF  [CAPC0603(1608)100_L]  (hidden comment: VJ0603Y104MXJCW1BC)
C44  value 100nF  [CAPC0603(1608)100_L]  (hidden comment: VJ0603Y104MXJCW1BC)
C45  value 100nF  [CAPC0603(1608)100_L]  (hidden comment: VJ0603Y104MXJCW1BC)
C46  value 100nF  [CAPC0603(1608)100_L]  (hidden comment: VJ0603Y104MXJCW1BC)
C47  GRM31CR60J476ME19L  [FP-GRM31C-0_2-e0_3_0_8-IPC_C]

### Nets
+3.3V_Analog: C42.1 C43.1
+3.3V_Ext: C44.2 C45.2 C46.2 C47.1
+5V_Ext: C41.1
GND: C41.2 C42.2 C43.2 C44.1 C45.1 C46.1 C47.2

### Notes on the sheet
- REVISION
- DESCRIPTION
- DATE
- APPROVED
- ADDRESS
- PROJECT
- VERSION
- TITLE
- A3
- SIZE
- SCALE
- DOCUMENT NAME:
- DOCUMENT REVISION:
- OF
- SHEET:
- PROJECT REVISION:

### Library data of the parts
C41 C47 = CMP-2000-06344-2: Chip Multilayer Ceramic Capacitors for General Purpose, 1206, 47uF, X5R, 15%, 20%, 6.3V; Package Quantity: 2000; Mount: Surface Mount; Length: 3.2mm; Thickness: 0.071inch; Lead Free: Lead Free; Tolerance: 20%; Width: 0.063inch; Depth: 1.6mm; Case/Package: 1206; Dielectric: X5R; Radiation Hardening: No; Packaging: Tape and Reel; Voltage Rating (DC): 6.3V; Termination: SMD/SMT; Height: 1.6mm; Max Operating Temperature: 85°C; Case Code (Metric): 3216; Case Code (Imperial): 1206; Voltage: 6.3V; Voltage Rating: 6.3V; Capacitance: 47uF; Min Operating Temperature: -55°C; Material: Ceramic; REACH SVHC: No SVHC
C42-C46 = CMP-001-00085-1: Multilayer Ceramic Capacitor, 0.1 uF, 16 V, ± 20%, X7R, 0603 [1608 Metric]; Dielectric Material: Tantalum; Voltage Rating: 16V; Packaging: Tape and Reel; Min Operating Temperature: -55°C; Case/Package: 0603; Length: 1.6mm; Termination: SMD/SMT; Height: 0.95mm; Mounting Technology: Surface Mount; Width: 0.8mm; Case Code (Imperial): 0603; Construction: Flat; Lead Free: Lead Free; Package Quantity: 4000; Max Operating Temperature: 125°C; Dielectric: X7R; RoHS Compliant: Yes; Depth: 0.8mm; Tolerance: 20%; Series: VJ; Case Code (Metric): 1608; Voltage Rating (DC): 16V

## Nets that join several sheets
+3.3V_Analog: fonte (C6.2 FB1.2), Main (U2.8 U2.32), Capacitores (C42.1 C43.1)
+3.3V_Ext: fonte (C7.2 FB1.1 U6.5), Main (5 pins), Capacitores (C44.2 C45.2 C46.2 C47.1)
+5V_Ext: fonte (8 pins), Amp_op1 (5 pins), Amp_op2 (5 pins), Amp_op3 (5 pins), Amp_op4 (5 pins), Capacitores (C41.1)
GND: fonte (13 pins), Amp_op1 (17 pins), Main (37 pins), Amp_op2 (17 pins), Amp_op3 (17 pins), Amp_op4 (17 pins), Capacitores (7 pins)
CH1_VOUT_SENSE: Amp_op1 (CH1_V.1 D1.2 F1.2), Main (J1.1)
CH2_VOUT_SENSE: Amp_op1 (CH2_V.1 D2.2 F2.2), Main (J1.3)
CH3_VOUT_SENSE: Amp_op1 (CH3_V.1 D3.2 F3.2), Main (J1.5)
CH4_VOUT_SENSE: Amp_op1 (CH4_V.1 D4.2 F4.2), Main (J1.7)
CH5_VOUT_SENSE: Main (J1.9), Amp_op2 (CH5_V.1 D5.2 F5.2)
CH6_VOUT_SENSE: Main (J1.11), Amp_op2 (CH6_V.1 D6.2 F6.2)
CH7_VOUT_SENSE: Main (J1.13), Amp_op2 (CH7_V.1 D7.2 F7.2)
CH8_VOUT_SENSE: Main (J1.15), Amp_op2 (CH8_V.1 D8.2 F8.2)
CH9_VOUT_SENSE: Main (J1.17), Amp_op3 (CH9_V.1 D9.2 F9.2)
CH10_VOUT_SENSE: Main (J1.19), Amp_op3 (CH10_V.1 D10.2 F10.2)
CH11_VOUT_SENSE: Main (J1.21), Amp_op3 (CH11_V.1 D11.2 F11.2)
CH12_VOUT_SENSE: Main (J1.23), Amp_op3 (CH12_V.1 D12.2 F12.2)
CH13_VOUT_SENSE: Main (J1.25), Amp_op4 (CH13_V.1 D13.2 F13.2)
CH14_VOUT_SENSE: Main (J1.27), Amp_op4 (CH14_V.1 D14.2 F14.2)
CH15_VOUT_SENSE: Main (J1.29), Amp_op4 (CH15_V.1 D15.2 F15.2)
CH16_VOUT_SENSE: Main (J1.31), Amp_op4 (CH16_V.1 D16.2 F16.2)
NetR21_2: Amp_op1 (R21.2), Main (U2.9)
NetR23_1: Amp_op1 (R23.1), Main (U2.10)
NetR24_1: Amp_op1 (R24.1), Main (U2.11)
NetR25_1: Amp_op1 (R25.1), Main (U2.12)
NetR29_1: Main (U2.13), Amp_op2 (R29.1)
NetR31_1: Main (U2.15), Amp_op2 (R31.1)
NetR32_1: Main (U2.16), Amp_op2 (R32.1)
NetR33_1: Main (U2.17), Amp_op2 (R33.1)
NetR37_1: Main (U2.21), Amp_op3 (R37.1)
NetR39_1: Main (U2.22), Amp_op3 (R39.1)
NetR40_1: Main (U2.23), Amp_op3 (R40.1)
NetR41_1: Main (U2.24), Amp_op3 (R41.1)
NetR45_1: Main (U2.25), Amp_op4 (R45.1)
NetR47_1: Main (U2.28), Amp_op4 (R47.1)
NetR48_1: Main (U2.29), Amp_op4 (R48.1)
NetR49_1: Main (U2.30), Amp_op4 (R49.1)